# Altium schematic sheet Controller.SchDoc
size 297 x 209 mm; SheetNumber: 5; SheetTotal: 9
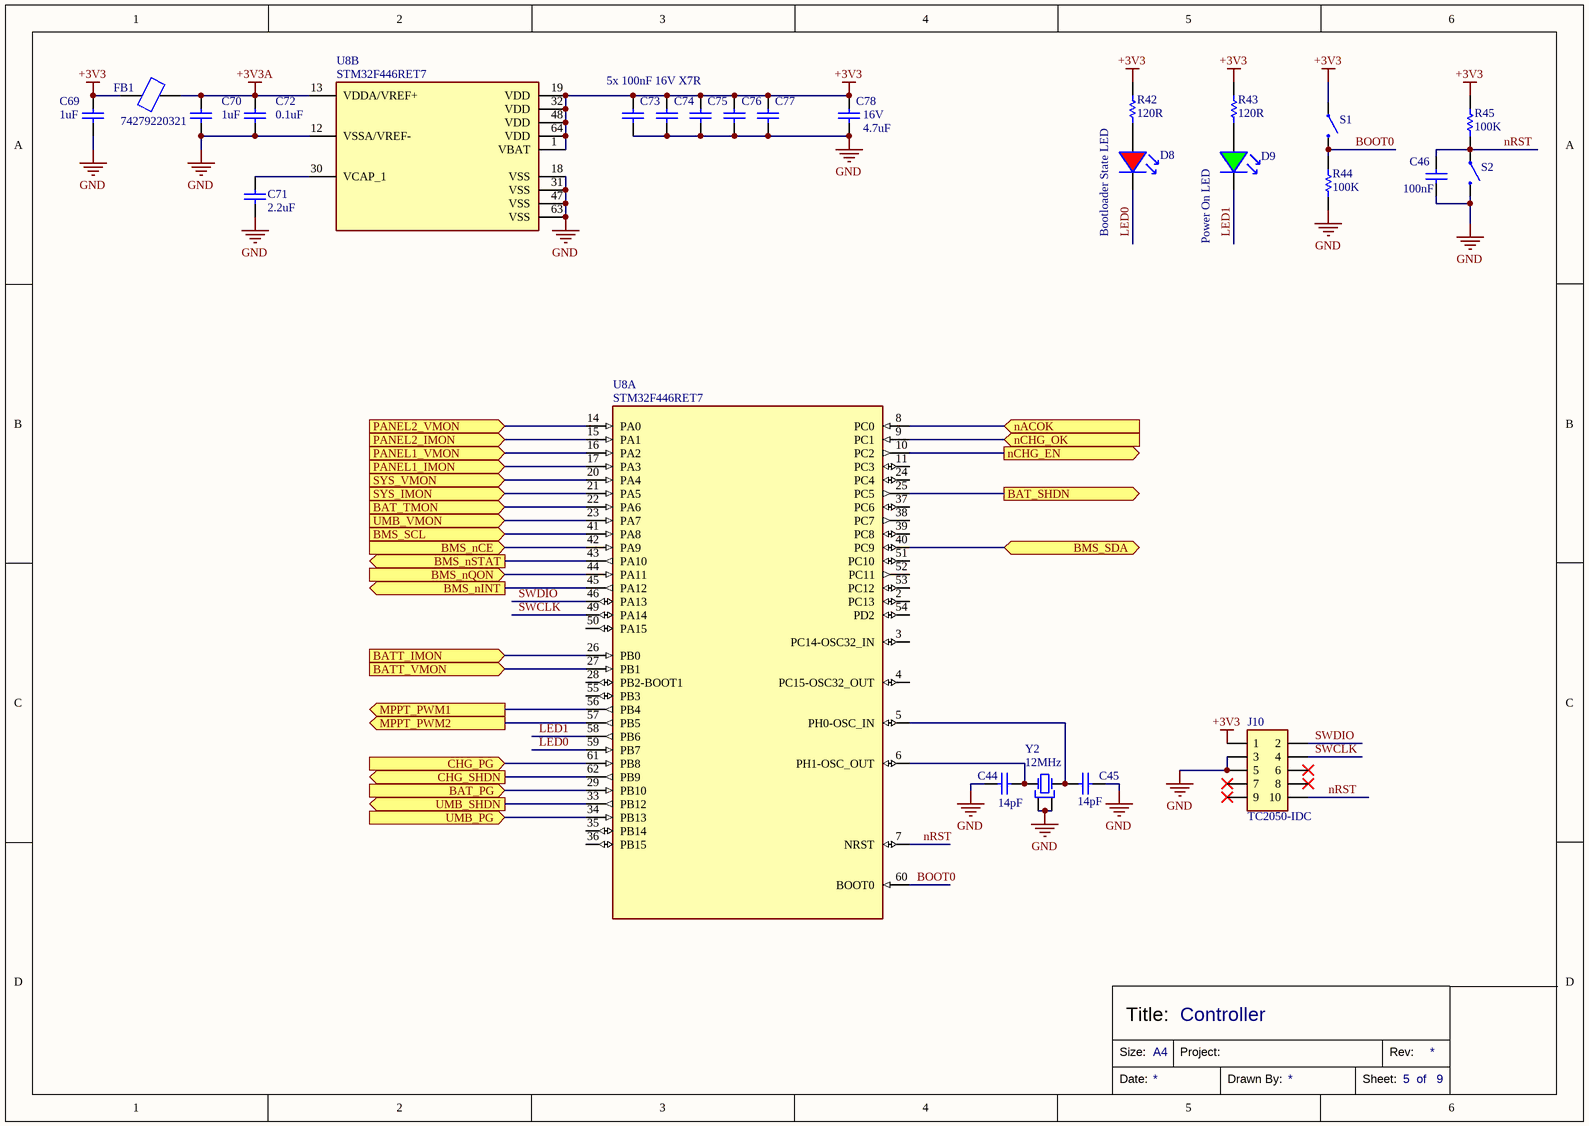
[diagram p0: Controller.SchDoc]

## Parts
C44  Capacitance: 14pF  [CAPC0402X020]  (hidden comment: GJM1555C1H140FB01D)
C45  Capacitance: 14pF  [CAPC0402X020]  (hidden comment: GJM1555C1H140FB01D)
C46  Capacitance: 100nF  [CAPC0603X040]  (hidden comment: CL10B104KO8NNNC)
C69  Capacitance: 1uF  [CAPC0603X040]  (hidden comment: CL10B105KO8NNNC)
C70  Capacitance: 1uF  [CAPC0603X040]  (hidden comment: CL10B105KO8NNNC)
C71  Capacitance: 2.2uF  [CAPC0805X060]  (hidden comment: CL21A225KBFNNNE)
C72  Capacitance: 0.1uF  [CAPC0402X020]  (hidden comment: CL05B104KB5NNNC)
C73  CL05B104KB5NNNC  [CAPC0402X020]  (value not drawn)
C74  CL05B104KB5NNNC  [CAPC0402X020]  (value not drawn)
C75  CL05B104KB5NNNC  [CAPC0402X020]  (value not drawn)
C76  CL05B104KB5NNNC  [CAPC0402X020]  (value not drawn)
C77  CL05B104KB5NNNC  [CAPC0402X020]  (value not drawn)
C78  Voltage Rating: 16V  Capacitance: 4.7uF  [CAPC0805X060]  (hidden comment: CL21B475KOFNFNE)
D8  LTST-C170EKT  [LEDR_0805]  (value not drawn)
D9  LTST-C170GKT  [LEDG_0805]  (value not drawn)
FB1  74279220321  [74279220321]
J10  TC2050-IDC  [TC2050-IDC]  (no BOM)
R42  Resistance: 120R  [RESC0805]  (hidden comment: RMCF0805FT120R)
R43  Resistance: 120R  [RESC0805]  (hidden comment: RMCF0805FT120R)
R44  Resistance: 100K  [RESC0603]  (hidden comment: RMCF0603FT100K)
R45  Resistance: 100K  [RESC0603]  (hidden comment: RMCF0603FT100K)
S1  B3U-1000P  [B3U-1000P]  (value not drawn)
S2  B3U-1000P  [B3U-1000P]  (value not drawn)
U8  STM32F446RET7  [LQFP-64]  (parts A,B of 2)
Y2  Frequency: 12MHz  [830069882]  (hidden comment: 830069882)

## Ports
BAT_PG (in, see Power_Path[2D]), BAT_SHDN (out, see Power_Path[2D]), BAT_TMON (in, see Power_Path[1C], Charger[2D]), BATT_IMON (in, see Power_Path[1D], Battery_Protection[6A]), BATT_VMON (in, see Power_Path[1C]), BMS_nCE (in, see Power_Path[1D]), BMS_nINT (out, see Power_Path[1D]), BMS_nQON (in, see Power_Path[1D]), BMS_nSTAT (out, see Power_Path[1D]), BMS_SCL (in, see Power_Path[1D]), BMS_SDA (bidir, see Power_Path[1D]), CHG_PG (in, see Power_Path[1D]), CHG_SHDN (out, see Power_Path[1D]), MPPT_PWM1 (out, see Power_Path[2C]), MPPT_PWM2 (out, see Power_Path[2C]), nACOK (in, see Power_Path[2D], Charger[3C]), nCHG_EN (out, see Power_Path[2D]), nCHG_OK (in, see Power_Path[2D], Charger[3C]), PANEL1_IMON (in, see Power_Path[2D], MPPT[3A]), PANEL1_VMON (in, see Power_Path[2C], MPPT[3B]), PANEL2_IMON (in, see Power_Path[2D], MPPT[3C]), PANEL2_VMON (in, see Power_Path[2C], MPPT[3D]), SYS_IMON (in, see Power_Path[1C]), SYS_VMON (in, see Power_Path[1C]), UMB_PG (in, see Power_Path[2D]), UMB_SHDN (out, see Power_Path[2D]), UMB_VMON (in, see Power_Path[1D])

## Nets
+3V3: C69.2 C73.2 C74.2 C75.2 C76.2 C77.2 C78.2 FB1.1 J10.1 R42.2 R43.2 R45.2 S1.1 U8.1(VBAT) U8.19(VDD) U8.32(VDD) U8.48(VDD) U8.64(VDD)
+3V3A: C70.2 C72.2 FB1.2 U8.13(VDDA/VREF+)
GND: C44.1 C45.1 C46.1 C69.1 C70.1 C71.1 C72.1 C73.1 C74.1 C75.1 C76.1 C77.1 C78.1 J10.3 J10.5 R44.1 S2.2 U8.12(VSSA/VREF-) U8.18(VSS) U8.31(VSS) U8.47(VSS) U8.63(VSS) Y2.2(OSC1) Y2.4(OSC1)
BAT_PG: U8.29(PB10) ; port BAT_PG
BAT_SHDN: U8.25(PC5) ; port BAT_SHDN
BAT_TMON: U8.22(PA6) ; port BAT_TMON
BATT_IMON: U8.26(PB0) ; port BATT_IMON
BATT_VMON: U8.27(PB1) ; port BATT_VMON
BMS_nCE: U8.42(PA9) ; port BMS_nCE
BMS_nINT: U8.45(PA12) ; port BMS_nINT
BMS_nQON: U8.44(PA11) ; port BMS_nQON
BMS_nSTAT: U8.43(PA10) ; port BMS_nSTAT
BMS_SCL: U8.41(PA8) ; port BMS_SCL
BMS_SDA: U8.40(PC9) ; port BMS_SDA
BOOT0: R44.2 S1.2 U8.60(BOOT0)
CHG_PG: U8.61(PB8) ; port CHG_PG
CHG_SHDN: U8.62(PB9) ; port CHG_SHDN
LED0: D8.K U8.59(PB7)
LED1: D9.K U8.58(PB6)
MPPT_PWM1: U8.56(PB4) ; port MPPT_PWM1
MPPT_PWM2: U8.57(PB5) ; port MPPT_PWM2
nACOK: U8.8(PC0) ; port nACOK
nCHG_EN: U8.10(PC2) ; port nCHG_EN
nCHG_OK: U8.9(PC1) ; port nCHG_OK
nRST: C46.2 J10.10 R45.1 S2.1 U8.7(NRST)
PANEL1_IMON: U8.17(PA3) ; port PANEL1_IMON
PANEL1_VMON: U8.16(PA2) ; port PANEL1_VMON
PANEL2_IMON: U8.15(PA1) ; port PANEL2_IMON
PANEL2_VMON: U8.14(PA0) ; port PANEL2_VMON
SWCLK: J10.4 U8.49(PA14)
SWDIO: J10.2 U8.46(PA13)
SYS_IMON: U8.21(PA5) ; port SYS_IMON
SYS_VMON: U8.20(PA4) ; port SYS_VMON
UMB_PG: U8.34(PB13) ; port UMB_PG
UMB_SHDN: U8.33(PB12) ; port UMB_SHDN
UMB_VMON: U8.23(PA7) ; port UMB_VMON
NetC44_2: C44.2 U8.6(PH1-OSC_OUT) Y2.1(OSC1)
NetC45_2: C45.2 U8.5(PH0-OSC_IN) Y2.3(OSC2)
NetC71_2: C71.2 U8.30(VCAP_1)
NetD8_A: D8.A R42.1
NetD9_A: D9.A R43.1

Not connected (* = marked no-connect by the designer): J10 6* 7* 8* 9*; U8 2(PC13) 3(PC14-OSC32_IN) 4(PC15-OSC32_OUT) 11(PC3) 24(PC4) 28(PB2-BOOT1) 35(PB14) 36(PB15) 37(PC6) 38(PC7) 39(PC8) 50(PA15) 51(PC10) 52(PC11) 53(PC12) 54(PD2) 55(PB3)

## Notes on the sheet
- 5x 100nF 16V X7R
- Bootloader State LED
- (near D9) Power On LED
- Controller
- Size:
- Title:
- A4
- Project:
- Rev:
- Date:
- Drawn By:
- Sheet:
- of

## Library data of the parts
C44 C45 = CAPC0402: 14 pF ±1% 50V Ceramic Capacitor C0G, NP0 0402 (1005 Metric); Part Number: GJM1555C1H140FB01D; Tolerance: 1%; Distributor Part Number: 2266-GJM1555C1H140FB01DTR-ND; Case Code: 0402; Distributor: Digikey; Voltage Rating: 50V
C46 = CAPC0603: 0.1 µF ±10% 16V Ceramic Capacitor X7R 0603 (1608 Metric); Manufacturer Part Number: CL10B104KO8NNNC; Tolerance: 10%; Distributor Part number: 1276-1005-1-ND; Case Code: 0603; Voltage Rating: 16V; Distributor: Digikey
C69 C70 = CAPC0603: 1 µF ±10% 16V Ceramic Capacitor X7R 0603 (1608 Metric); Manufacturer Part Number: CL10B105KO8NNNC; Tolerance: 10%; Distributor Part number: 1276-1019-1-ND; Case Code: 0603; Voltage Rating: 16V; Distributor: Digikey
C71 = CL21A225KBFNNNE: 2.2uF ±10% 25V Ceramic Capacitor X7R 0805 (2012 Metric); Part Number: CL21A225KBFNNNE; Distributor Part Number: 1276-6702-1-ND; Tolerance: 10%; Case Code: 0805; Distributor: Digikey; Voltage Rating: 25V
C72 = CL05B104KB5NNNC: 0.1 µF ±10% 50V Ceramic Capacitor X7R 0402 (1005 Metric); Part Number: CL05B104KB5NNNC; Tolerance: 10%; Distributor Part Number: 1276-CL05B104KB5NNNCCT-ND; Case Code: 0402; Distributor: Digikey; Voltage Rating: 50V
C73-C77 = CL05B104KB5NNNC: 0.1 µF ±10% 50V Ceramic Capacitor X7R 0402 (1005 Metric); Capacitance: 0.1uF; Part Number: CL05B104KB5NNNC; Tolerance: 10%; Distributor Part Number: 1276-CL05B104KB5NNNCCT-ND; Case Code: 0402; Distributor: Digikey; Voltage Rating: 50V
C78 = CL21B475KOFNFNE: 4.7 µF ±10% 16V Ceramic Capacitor X7R 0805 (2012 Metric); Distributor Part Number: 1276-2970-1-ND; Tolerance: 10%; Case Code: 0805; Distributor: Digikey; Part Number: CL21B475KOFNFNE
D8 = LEDR0805: Red 621nm LED Indication - Discrete 2V 0805 (2012 Metric); Manufacturer Part Number: LTST-C170EKT; Distributor Part Number: 160-1178-1-ND; Colour: Red; Operating Temperature: *; Distributor: Digikey
D9 = LEDG0805: Green 569nm LED Indication - Discrete 2.1V 0805 (2012 Metric); Manufacturer Part Number: LTST-C170GKT; Distributor Part Number: 160-1179-1-ND; Colour: Green; Operating Temperature: *; Distributor: Digikey
FB1 = 74279220321: Ferrite Bead 320 Ohms @ 100 MHz 1 Ferrite Bead 0805 (2012 Metric) 2.5A 50mOhm; Part Number: 74279220321; Distributor Part Number: 732-6125-1-ND; Distributor: Digikey; Operating Temperature: -55°C ~ 125°C; Impedance: 320 Ohms @ 100 MHz; Current Rating: 2.5A; DCR: 50mOhm
J10 = TC2050-IDC: JTAG Pogo Programmer Pads; Programmer Part Number: TC2050-IDC
R42 R43 = RMCF0805FT120R: 120 Ohms ±1% 0.125W, 1/8W Chip Resistor 0805 (2012 Metric) Automotive AEC-Q200 Thick Film; Part Number: RMCF0805FT120R; Tolerance: 1%; Distributor Part Number: 738-RMCF0805FT120RCT-ND; Distributor: Digikey; Case Code: 0805
R44 R45 = RMCF0603FT100K: 100 kOhms ±1% 0.1W, 1/10W Chip Resistor 0603 (1608 Metric) Automotive AEC-Q200 Thick Film; Part Number: RMCF0603FT100K; Tolerance: 1%; Distributor: Digikey; Distributor Part Number: RMCF0603FT100KCT-ND; Case Code: 0603
S1 S2 = B3U-1000P: Tactile Switch SPST-NO Top Actuated Surface Mount; Part Number: B3U-1000P; Distributor: Digikey; Distributor Part Number: SW1020CT-ND; Operating Temperature: -25°C ~ 70°C
U8 = STM32F446RET7: ARM® Cortex®-M4 STM32F4 Microcontroller IC 32-Bit 180MHz 512KB (512K x 8) FLASH 64-LQFP (10x10); Part Number: STM32F446RET6; RAM Size: 128K x 8; Voltage - Supply: 1.7V ~ 3.6V; Distributor: Mouser; Distributor Part Number: 511-STM32F446RET7; Core Size: 32-Bit; Speed: 180MHz; ComponentLink1Description: Datasheet; ComponentLink1URL: *; Operating Temperature: -40C~105C
Y2 = 830069882: Crystals 12.0 MHZ 18PF 20PPM 120OHM; Load Capacitance: 10pF; ESR: 100R; Distributor Part Number: *; Part Number: 830069882; Operating Temperature: -40C to 125C; Distributor: *